# Altium project SQUIDCtr_Rev2.PrjPCB (part 2 of 2)

## Sheet Power.SchDoc: Power and Mechanical
size Letter; DrawnBy: J.-F. Cliche & Adam Gilbert; Engineer: J.-F. Cliche; DocumentNumber: 4; Revision: Rev2; SheetNumber: 4; SheetTotal: 5; ProjectTitle: DAN Squid Controller
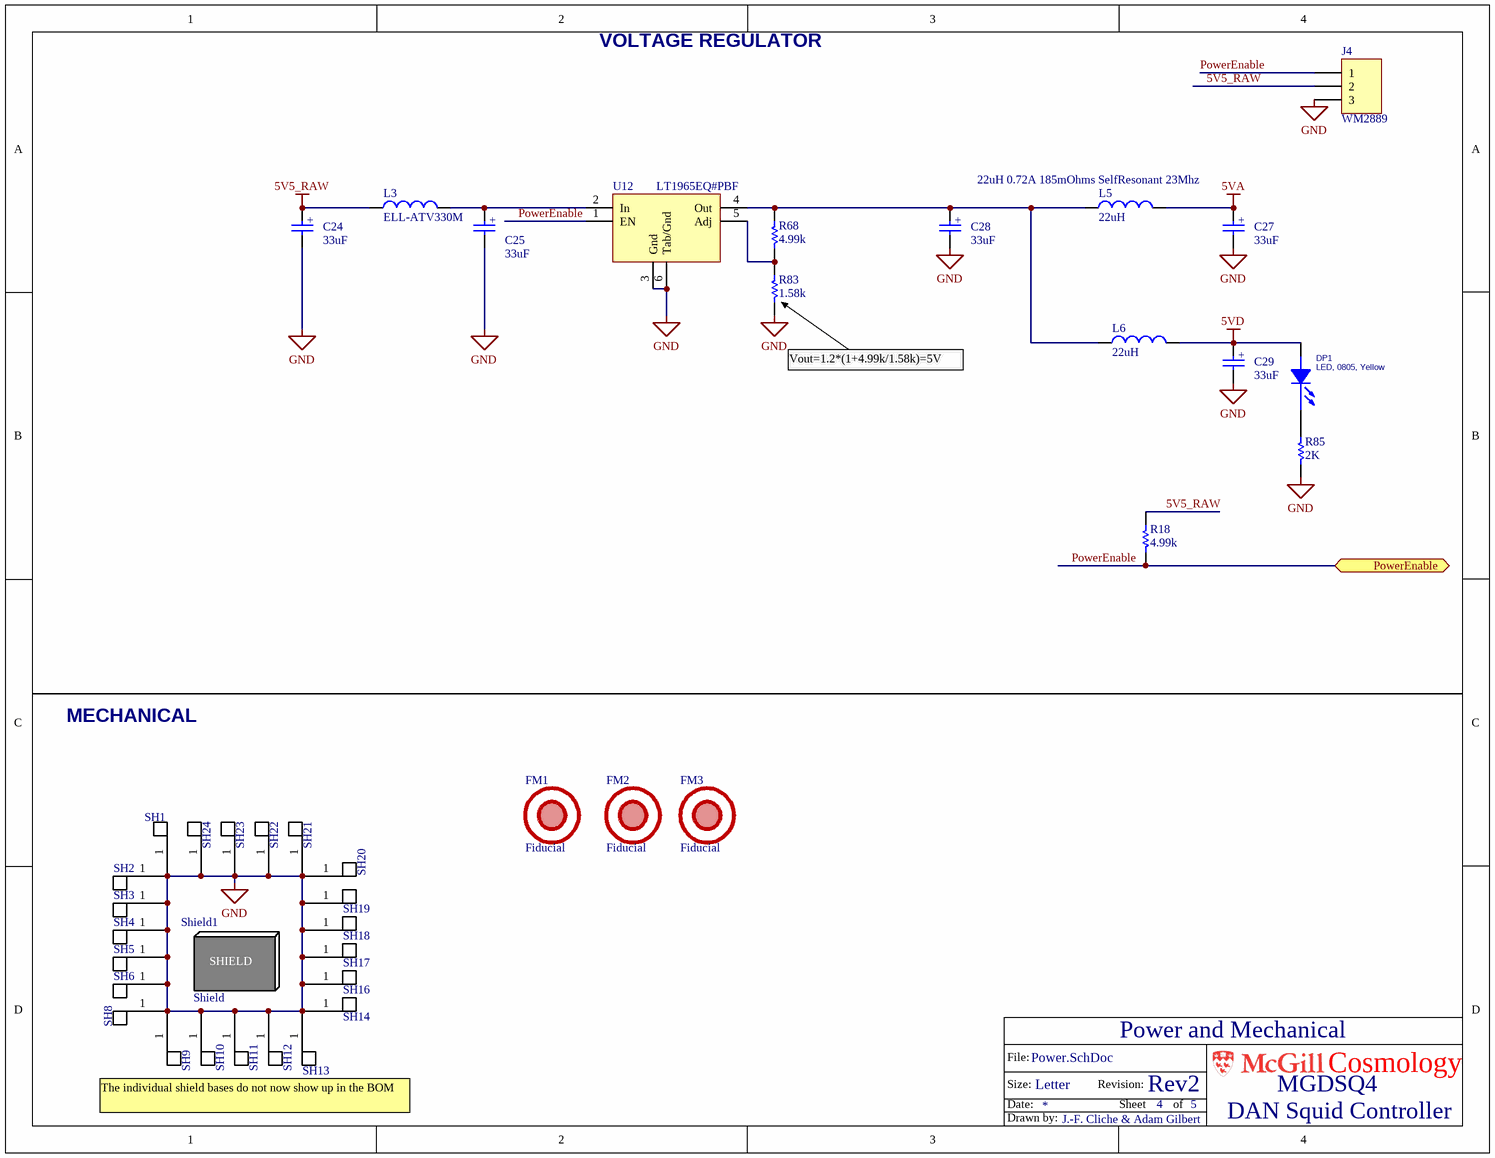
[diagram p3: Power.SchDoc]

### Parts
C24  33uF  [TCASE-D]
C25  33uF  [TCASE-D]
C27  33uF  [TCASE-D]
C28  33uF  [TCASE-D]
C29  33uF  [TCASE-D]
DP1  LED, 0805, Yellow  [0805L]
FM1  Fiducial  [Fiducial_mark]  (no BOM)
FM2  Fiducial  [Fiducial_mark]  (no BOM)
FM3  Fiducial  [Fiducial_mark]  (no BOM)
J4  WM2889  [HDR1X3_MolexVertical]
L3  ELL-ATV330M  [ELLATV]
L5  22uH  PartConstraints: 22uH 0.72A 185mOhms SelfResonant 23Mhz  [SRR4028]
L6  22uH  [SRR4028]
R18  4.99k  [0603]
R68  4.99k  [0603]
R83  1.58k  [0603]
R85  2k  [0603]
SH1  LeaderTech 20S-CBS-2x0.5x0.2 - DIVIDE QUANITY REQURIED BY 10!  [SHIELD BASE CORNER]  (value not drawn)  (no BOM)
SH2  LeaderTech 20S-CBS-2x0.5x0.2 - DIVIDE QUANITY REQURIED BY 10!  [SHIELD BASE]  (value not drawn)  (no BOM)
SH3  LeaderTech 20S-CBS-2x0.5x0.2 - DIVIDE QUANITY REQURIED BY 10!  [SHIELD BASE]  (value not drawn)  (no BOM)
SH4  LeaderTech 20S-CBS-2x0.5x0.2 - DIVIDE QUANITY REQURIED BY 10!  [SHIELD BASE]  (value not drawn)  (no BOM)
SH5  LeaderTech 20S-CBS-2x0.5x0.2 - DIVIDE QUANITY REQURIED BY 10!  [SHIELD BASE]  (value not drawn)  (no BOM)
SH6  LeaderTech 20S-CBS-2x0.5x0.2 - DIVIDE QUANITY REQURIED BY 10!  [SHIELD BASE]  (value not drawn)  (no BOM)
SH8  LeaderTech 20S-CBS-2x0.5x0.2 - DIVIDE QUANITY REQURIED BY 10!  [SHIELD BASE CORNER]  (value not drawn)  (no BOM)
SH9  LeaderTech 20S-CBS-2x0.5x0.2 - DIVIDE QUANITY REQURIED BY 10!  [SHIELD BASE]  (value not drawn)  (no BOM)
SH10  LeaderTech 20S-CBS-2x0.5x0.2 - DIVIDE QUANITY REQURIED BY 10!  [SHIELD BASE]  (value not drawn)  (no BOM)
SH11  LeaderTech 20S-CBS-2x0.5x0.2 - DIVIDE QUANITY REQURIED BY 10!  [SHIELD BASE]  (value not drawn)  (no BOM)
SH12  LeaderTech 20S-CBS-2x0.5x0.2 - DIVIDE QUANITY REQURIED BY 10!  [SHIELD BASE]  (value not drawn)  (no BOM)
SH13  LeaderTech 20S-CBS-2x0.5x0.2 - DIVIDE QUANITY REQURIED BY 10!  [SHIELD BASE CORNER]  (value not drawn)  (no BOM)
SH14  LeaderTech 20S-CBS-2x0.5x0.2 - DIVIDE QUANITY REQURIED BY 10!  [SHIELD BASE]  (value not drawn)  (no BOM)
SH16  LeaderTech 20S-CBS-2x0.5x0.2 - DIVIDE QUANITY REQURIED BY 10!  [SHIELD BASE]  (value not drawn)  (no BOM)
SH17  LeaderTech 20S-CBS-2x0.5x0.2 - DIVIDE QUANITY REQURIED BY 10!  [SHIELD BASE]  (value not drawn)  (no BOM)
SH18  LeaderTech 20S-CBS-2x0.5x0.2 - DIVIDE QUANITY REQURIED BY 10!  [SHIELD BASE]  (value not drawn)  (no BOM)
SH19  LeaderTech 20S-CBS-2x0.5x0.2 - DIVIDE QUANITY REQURIED BY 10!  [SHIELD BASE]  (value not drawn)  (no BOM)
SH20  LeaderTech 20S-CBS-2x0.5x0.2 - DIVIDE QUANITY REQURIED BY 10!  [SHIELD BASE CORNER]  (value not drawn)  (no BOM)
SH21  LeaderTech 20S-CBS-2x0.5x0.2 - DIVIDE QUANITY REQURIED BY 10!  [SHIELD BASE]  (value not drawn)  (no BOM)
SH22  LeaderTech 20S-CBS-2x0.5x0.2 - DIVIDE QUANITY REQURIED BY 10!  [SHIELD BASE]  (value not drawn)  (no BOM)
SH23  LeaderTech 20S-CBS-2x0.5x0.2 - DIVIDE QUANITY REQURIED BY 10!  [SHIELD BASE]  (value not drawn)  (no BOM)
SH24  LeaderTech 20S-CBS-2x0.5x0.2 - DIVIDE QUANITY REQURIED BY 10!  [SHIELD BASE]  (value not drawn)  (no BOM)
Shield1  Shield
U12  LT1965EQ#PBF  [D2-PAK-6_LT3080]

### Ports
PowerEnable

### Nets
5V5_RAW: C24.1 J4.2 L3.1 R18.2
5VA: C27.1 L5.2
5VD: C29.1 DP1.1(ANODE) L6.2
GND: C24.2 C25.2 C27.2 C28.2 C29.2 J4.3 R83.1 R85.2 SH1.1 SH2.1 SH3.1 SH4.1 SH5.1 SH6.1 SH8.1 SH9.1 SH10.1 SH11.1 SH12.1 SH13.1 SH14.1 SH16.1 SH17.1 SH18.1 SH19.1 SH20.1 SH21.1 SH22.1 SH23.1 SH24.1 U12.3(Gnd) U12.6(Tab/Gnd)
PowerEnable: J4.1 R18.1 U12.1(EN) ; port PowerEnable
NetC25_1: C25.1 L3.2 U12.2(In)
NetC28_1: C28.1 L5.1 L6.1 R68.2 U12.4(Out)
NetDP1_2: DP1.2(CATHODE) R85.1
NetR68_1: R68.1 R83.2 U12.5(Adj)

### Notes on the sheet
- VOLTAGE REGULATOR
- (near R83) Vout=1.2*(1+4.99k/1.58k)=5V
- MECHANICAL
- The individual shield bases do not now show up in the BOM
- File:
- Size:
- Date:
- Letter
- Revision:
- Sheet
- of
- Cosmology
- Drawn by:
- (in symbol SHIELD 20S-CBS-3x2.5x0.2) SHIELD
- (in symbol Tantalum) +

### Library data of the parts
C24 C25 C27-C29 = Tantalum: CAP TANT CASE-D; Manufacturer: Generic; Part Constraints: CAP TANT 33UF 16V 20% 2917; Voltage: 16V; ESR: 100mOhms; Footprint: D; Value: 33uF; Supplier 1: Digi-Key
  C24: Supplier Part Number 1: 399-4738-2-ND; Supplier 2: Digi-Key; Supplier Part Number 2: 399-4738-1-ND
  C25 C27-C29: Supplier Part Number 1: 399-4738-1-ND
DP1 = LED, yellow, 0805, 2mA: LED; Part Constraints: 511-1293-1-ND; Supplier 1: Digi-Key; Supplier Part Number 1: 511-1293-1-ND
J4 = Header 3: 3-Pin 0.1" header; Manufacturer: Digikey; Part Constraints: WM2889; Supplier 1: Molex; Supplier Part Number 1: WM2889-ND
L3 = ELL-ATV330M: 33uH 1.8A inductor 10mmx10mm; Manufacturer: Panasonic - ECG; Inductance: 33µH; Type: Ferrite Core; Tolerance: ±20%; Shielding: Shielded; DC Resistance (DCR): 62 mOhm; Frequency - Test: 100kHz; RoHS: RoHS Compliant; Category: Inductors, Coils, Chokes; Stock 1: 6281; Pricing 1: 1=2.28, 10=2.15, 50=2.0154, 100=1.8811 (CAD); Current: 1.8A; Current - Saturation: -; Current - Temperature Rise: -; Q @ Freq: -; Frequency - Self Resonant: -; Applications: General Purpose; Material - Core: -; Package / Case: 0.394" L x 0.394" W x 0.177" H (10.00mm x 10.00mm x 4.50mm); Mounting Type: Surface Mount; Packaging: Cut Tape (CT); Operating Temperature: -; ComponentLink1URL: http://industrial.panasonic.com/www-cgi/jvcr13pz.cgi?E+PZ+2+AGM0010+0+4+WW; ComponentLink1Description: http://industrial.panasonic.com/www-cgi/jvcr13pz.cgi?E+PZ+2+AGM0010+0+4+WW; Supplier 1: Digi-Key; Supplier Part Number 1: PCD1754CT-ND; Part Constraints: ELL-ATV330M
L5 = InductorSRR4028: =PartConstraints; Manufacturer: Bourns; Part Constraints: SRR4028-220YCT-ND; Resistance: 185mOhms; CurrentRating: 0.72A; SRF: SelfResonant 23Mhz; Inductance: 22uH; Supplier 1: Digi-Key; Supplier Part Number 1: SRR4028-220YCT-ND
L6 = InductorSRR4028: =PartConstraints; Manufacturer: Bourns; PartConstraints: 22uH 0.72A 185mOhms SelfResonant 23Mhz; Part Constraints: SRR4028-220YCT-ND; Resistance: 185mOhms; CurrentRating: 0.72A; SRF: SelfResonant 23Mhz; Inductance: 22uH; Supplier 1: Digi-Key; Supplier Part Number 1: SRR4028-220YCT-ND
R18 R68 = Res0603: RES 0603; Manufacturer: Generic; Part constraints: RES 4.99K OHM 1/10W 1% 0603 SMD; Manufacturer Part Number 1: e.g CRCW0603 series; Value: 4.99k; Supplier 1: Digi-Key; Supplier Part Number 1: 541-4.99KHCT-ND
R83 = Res0603: RES 0603; Manufacturer: Generic; Part constraints: RES 1.58K OHM 1/10W 1% 0603 SMD; Manufacturer Part Number 1: e.g CRCW0603 series; Value: 1.58k; Supplier 1: Digi-Key; Supplier Part Number 1: 541-1.58KHCT-ND
R85 = Res0603: RES 0603; Manufacturer: Generic; Part constraints: RES 2.00K OHM 1/10W 1% 0603 SMD; Manufacturer Part Number 1: e.g CRCW0603 series; Value: 2K; Supplier 1: Digi-Key; Supplier Part Number 1: 541-2.00KHCT-ND
SH1-SH6 SH8-SH14 SH16-SH24 = ShieldBase: Part Constraints: 20S-CBS-3x2.5x0.2  (divide quantity by 22); Manufacturer: LeaderTech; Supplier 1: LeaderTech; Supplier Part Number 1: 20S-CBS-3x2.5x0.2  (divide quantity by 22)
Shield1 = SHIELD 20S-CBS-3x2.5x0.2: 20S-CBSA-3x2.5x0.2 (assembled fence and cover); Manufacturer: Leadertech; Supplier 1: Leadertech; Supplier Part Number 1: 20S-CBSA-3x2.5x0.2 (assembled fence and cover); Part Constraints: 20S-CBSA-3x2.5x0.2 (assembled fence and cover)
U12 = LT1965EQ: Low dropout regulator, single resistor, 1.1A; Manufacturer 1: Linear Technology; Description 1: IC REG LDO ADJ 1.1A 5-DD; Category 1: Integrated Circuits (ICs); Regulator Topology: Positive Adjustable; Voltage - Output: 1.2 V ~ 19.5 V; Voltage - Input: 1.8 V ~ 20 V; Voltage - Dropout (Typical): 0.31V @ 1.1A; Number of Regulators: 1; Current - Limit (Min): 1.2A; Supplier 1: Digi-Key; Manufacturer Part Number 1: LT1965EQ#PBF; RoHS 1: RoHS Compliant; Stock 1: 1301; Pricing 1: 1=4.88, 25=3.486, 100=2.8753 (CAD); Current - Output: 1.1A; Operating Temperature: -40°C ~ 125°C; Mounting Type: Surface Mount; Package / Case: TO-263-6, D²Pak (5 Leads + Tab), TO-263BA; Supplier Device Package: D2PAK-5; Packaging: Tube; ComponentLink1URL: http://www.linear.com/docs/25320; ComponentLink1Description: http://www.linear.com/docs/25320; Supplier Part Number 1: LT1965EQ#PBF-ND

## Sheet Control.SchDoc: Control logic
size Letter; DrawnBy: J.-F. Cliche & Adam Gilbert; Engineer: J.-F. Cliche; DocumentNumber: 5; Revision: Rev2; SheetNumber: 5; SheetTotal: 5; ProjectTitle: DAN Squid Controller
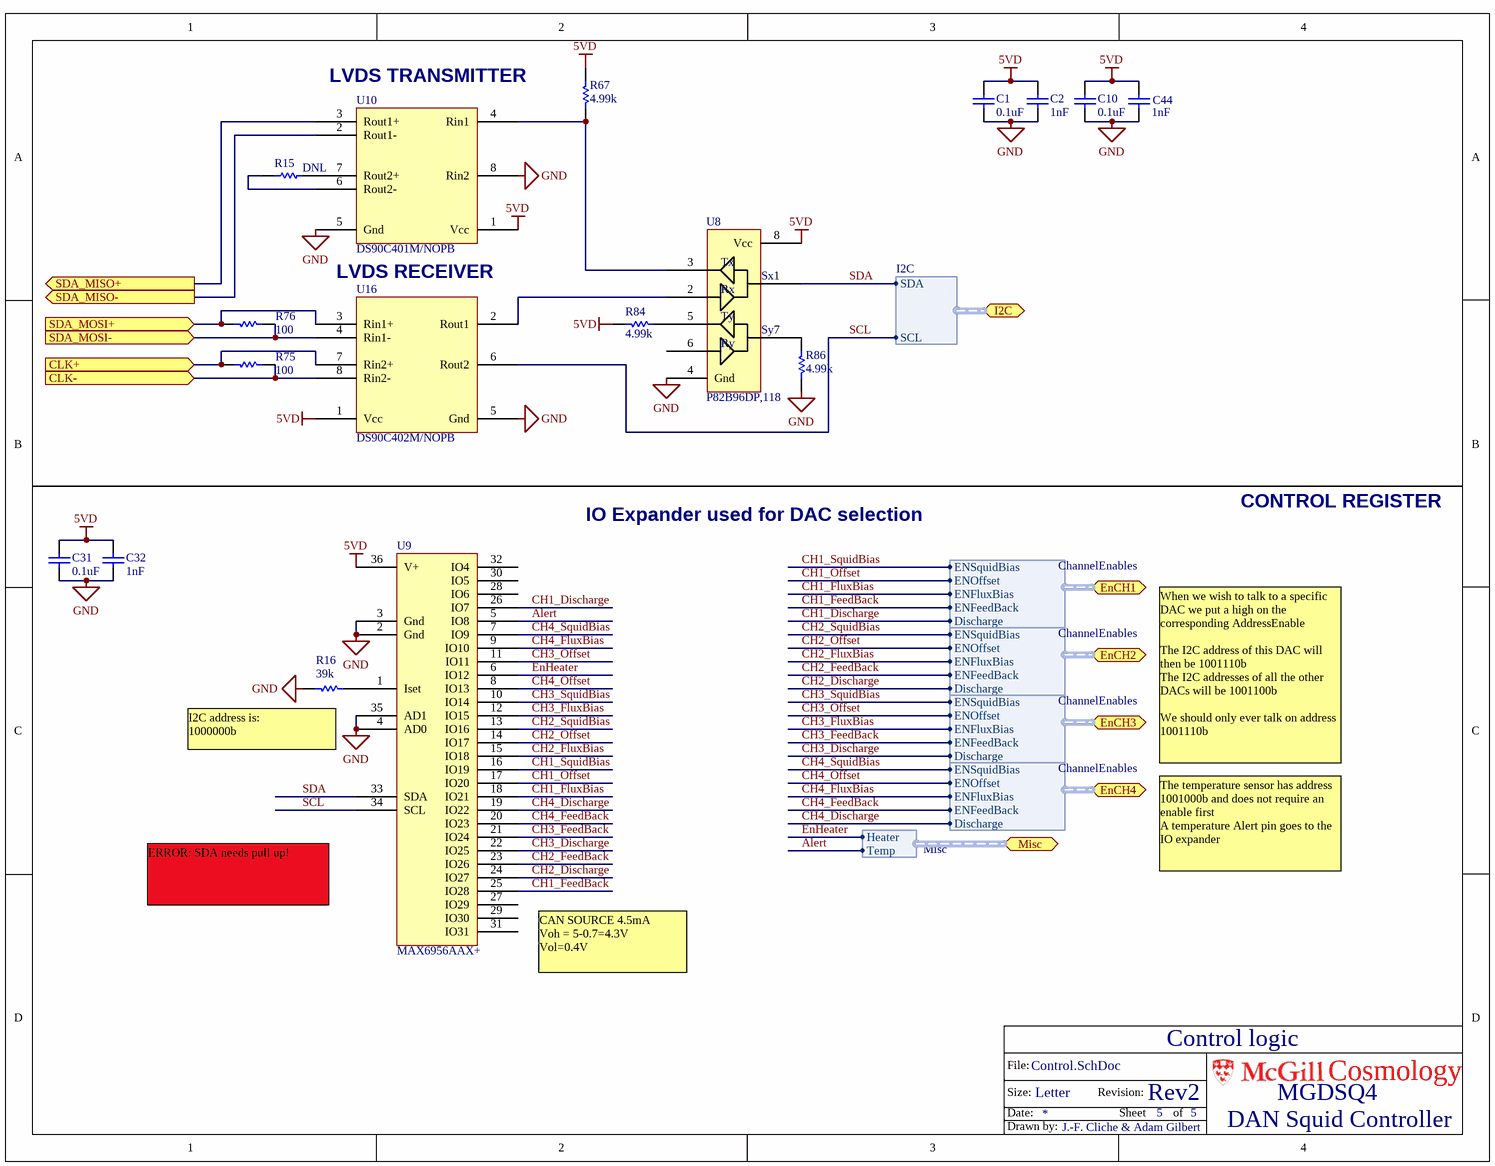
[diagram p4: Control.SchDoc]

### Parts
C1  0.1uF  [0603]
C2  1nF  [0603]
C10  0.1uF  [0603]
C31  0.1uF  [0603]
C32  1nF  [0603]
C44  1nF  [0603]
R15  DNL  [0603]
R16  39k
R67  4.99k  [0603]
R75  100  [0603]
R76  100  [0603]
R84  4.99k  [0603]
R86  4.99k  [0603]
U8  P82B96DP,118  [MSOP8-P82B96]
U9  MAX6956AAX+  [SOP36Body15.4mmx7.5mm]
U10  DS90C401M/NOPB  [SO8]
U16  DS90C402M/NOPB  [SO8]

### Ports
CLK+ (in), CLK- (in), EnCH1 (harness ChannelEnables), EnCH2 (harness ChannelEnables), EnCH3 (harness ChannelEnables), EnCH4 (harness ChannelEnables), I2C (harness I2C), Misc (harness Misc), SDA_MISO+ (out), SDA_MISO- (out), SDA_MOSI+ (in), SDA_MOSI- (in)

### Harnesses
I2C: SDA, SCL
ChannelEnables: ENSquidBias, ENOffset, ENFluxBias, ENFeedBack, Discharge
Misc: Heater, Temp

### Nets
5VD: C1.2 C2.2 C10.2 C31.2 C32.2 C44.2 R67.2 R84.2 U8.8(Vcc) U9.36(V+) U10.1(Vcc) U16.1(Vcc)
GND: C1.1 C2.1 C10.1 C31.1 C32.1 C44.1 R16.2 R86.1 U8.4(Gnd) U9.2(Gnd) U9.3(Gnd) U9.4(AD0) U9.35(AD1) U10.5(Gnd) U10.8(Rin2) U16.5(Gnd)
Alert: U9.5(IO8) ; port Misc.Temp
CH1_Discharge: U9.26(IO7) ; port EnCH1.Discharge  [project net EnCh1.Discharge]
CH1_FeedBack: U9.25(IO28) ; port EnCH1.ENFeedBack  [project net EnCh1.ENFeedBack]
CH1_FluxBias: U9.18(IO21) ; port EnCH1.ENFluxBias  [project net EnCh1.ENFluxBias]
CH1_Offset: U9.17(IO20) ; port EnCH1.ENOffset  [project net EnCh1.ENOffset]
CH1_SquidBias: U9.16(IO19) ; port EnCH1.ENSquidBias  [project net EnCh1.ENSquidBias]
CH2_Discharge: U9.24(IO27) ; port EnCH2.Discharge  [project net EnCh2.Discharge]
CH2_FeedBack: U9.23(IO26) ; port EnCH2.ENFeedBack  [project net EnCh2.ENFeedBack]
CH2_FluxBias: U9.15(IO18) ; port EnCH2.ENFluxBias  [project net EnCh2.ENFluxBias]
CH2_Offset: U9.14(IO17) ; port EnCH2.ENOffset  [project net EnCh2.ENOffset]
CH2_SquidBias: U9.13(IO16) ; port EnCH2.ENSquidBias  [project net EnCh2.ENSquidBias]
CH3_Discharge: U9.22(IO25) ; port EnCH3.Discharge  [project net EnCh3.Discharge]
CH3_FeedBack: U9.21(IO24) ; port EnCH3.ENFeedBack  [project net EnCh3.ENFeedBack]
CH3_FluxBias: U9.12(IO15) ; port EnCH3.ENFluxBias  [project net EnCh3.ENFluxBias]
CH3_Offset: U9.11(IO11) ; port EnCH3.ENOffset  [project net EnCh3.ENOffset]
CH3_SquidBias: U9.10(IO14) ; port EnCH3.ENSquidBias  [project net EnCh3.ENSquidBias]
CH4_Discharge: U9.19(IO22) ; port EnCH4.Discharge  [project net EnCh4.Discharge]
CH4_FeedBack: U9.20(IO23) ; port EnCH4.ENFeedBack  [project net EnCh4.ENFeedBack]
CH4_FluxBias: U9.9(IO10) ; port EnCH4.ENFluxBias  [project net EnCh4.ENFluxBias]
CH4_Offset: U9.8(IO13) ; port EnCH4.ENOffset  [project net EnCh4.ENOffset]
CH4_SquidBias: U9.7(IO9) ; port EnCH4.ENSquidBias  [project net EnCh4.ENSquidBias]
EnHeater: U9.6(IO12) ; port Misc.Heater
SCL: U9.34(SCL) U16.6(Rout2) ; port I2C.SCL  [project net I2C.SCL]
SCL_N: R75.1 U16.8(Rin2-) ; port CLK-
SCL_P: R75.2 U16.7(Rin2+) ; port CLK+
SDA: U8.1(Sx) U9.33(SDA) ; port I2C.SDA  [project net I2C.SDA]
SDA_MISO_N: U10.2(Rout1-) ; port SDA_MISO-
SDA_MISO_P: U10.3(Rout1+) ; port SDA_MISO+
SDA_MOSI_N: R76.1 U16.4(Rin1-) ; port SDA_MOSI-
SDA_MOSI_P: R76.2 U16.3(Rin1+) ; port SDA_MOSI+
NetR15_1: R15.1 U10.6(Rout2-)
NetR15_2: R15.2 U10.7(Rout2+)
NetR16_1: R16.1 U9.1(Iset)
NetR67_1: R67.1 U8.3(Tx) U10.4(Rin1)
NetR84_1: R84.1 U8.5(Ty)
NetR86_2: R86.2 U8.7(Sy)
NetU8_2: U8.2(Rx) U16.2(Rout1)

Not connected (* = marked no-connect by the designer): U8 6(Ry); U9 27(IO29) 28(IO6) 29(IO30) 30(IO5) 31(IO31) 32(IO4)

### Notes on the sheet
- (near U10) LVDS TRANSMITTER
- LVDS RECEIVER
- CONTROL REGISTER
- IO Expander used for DAC selection
- (near R16) I2C address is:
  1000000b
- When we wish to talk to a specific DAC we put a high on the corresponding AddressEnable
  The I2C address of this DAC will then be 1001110b
  The I2C addresses of all the other DACs will be 1001100b
  We should only ever talk on address 1001110b
- ERROR: SDA needs pull up!
- The temperature sensor has address 1001000b and does not require an enable first
  A temperature Alert pin goes to the IO expander
- CAN SOURCE 4.5mA
  Voh = 5-0.7=4.3V
  Vol=0.4V
- Labels drawn without touching a wire or pin: SCL
- File:
- Size:
- Date:
- Letter
- Revision:
- Sheet
- of
- Cosmology
- Drawn by:

### Library data of the parts
C1 C10 C31 = Cap0603: Capacitor, Ceramic, 0603; Part Constraints: 0.1uF 16V 10% X7R; Manufacturer: Generic; Supplier 1: Digi-Key; Supplier Part Number 1: 399-1096-1-ND; Value: 0.1uF
C2 C32 C44 = Cap0603: Capacitor, Ceramic, 0603; Part Constraints: 1nF 50V 10% X7R 0603; Manufacturer: Generic; Value: 1nF; Supplier 1: Digi-Key; Supplier Part Number 1: 399-1082-1-ND
R15 = Res0603: RES 0603; Manufacturer: Generic; Manufacturer Part Number 1: e.g CRCW0603 series; Value: DNL; Part constraints: DNL
R16 = RES 0603: Manufacturer: Generic; Manufacturer Part Number 1: CRCW060339K0FKEA; Part constraints: RES 100 OHM 1/10W 1% 0603 SMD; Manufacturer 1: Vishay Dale; Description 1: RES 39.0K OHM 1/10W 1% 0603 SMD; Category 1: Resistors; Power (Watts): 0.1W, 1/10W; Temperature Coefficient: ±100ppm/°C; Tolerance: ±1%; Footprint: 0603; Value: 39k; Supplier 1: Digi-Key; Supplier Part Number 1: 541-39.0KHCT-ND; RoHS 1: RoHS Compliant; Stock 1: 44932; Pricing 1: 10=0.096, 50=0.0516, 200=0.02965, 1000=0.02023 (CAD); Resistance (Ohms): 39k; Composition: Thick Film; Features: Automotive AEC-Q200 Qualified; Package / Case: 0603 (1608 Metric); Supplier Device Package: 0603 (1608 Metric); Size / Dimension: 0.061" L x 0.033" W (1.55mm x 0.85mm); Height: 0.020" (0.50mm); Number of Terminations: 2; Packaging: Cut Tape (CT); ComponentLink1URL: http://www.vishay.com/doc?20035; ComponentLink1Description: http://www.vishay.com/doc?20035
R67 R84 R86 = Res0603: as R18 on sheet Power; Value: 4.99k; Supplier 1: Digi-Key; Supplier Part Number 1: 541-4.99KHCT-ND
R75 R76 = RES 0603: Manufacturer: Generic; Manufacturer Part Number 1: e.g CRCW0603 series; Part constraints: RES 100 OHM 1/10W 1% 0603 SMD; Value: 100; Supplier 1: Digi-Key; Supplier Part Number 1: 541-100HCT-ND
U8 = P82B96: IC DUAL BI-DIR BUS BUFFER 8-TSSOP; Manufacturer 1: NXP Semiconductors; Description 1: IC DUAL BUS BUFF 8-TSSOP; Category 1: Integrated Circuits (ICs); Tx/Rx Type: I²C Logic; Delay Time: 5.0ns; Capacitance - Input: 7pF; Voltage - Supply: 2 V ~ 15 V; Current - Supply: 900µA; Supplier 1: Digi-Key; Manufacturer Part Number 1: P82B96DP,118; RoHS 1: RoHS Compliant; Stock 1: 6660; Pricing 1: 1=3.55, 10=3.18, 25=2.8588, 100=2.6001, 250=2.35368, 500=2.1072, 1000=1.77448 (CAD); Type: Buffer; Mounting Type: Surface Mount; Package / Case: 8-TSSOP, 8-MSOP (0.118", 3.00mm Width); Supplier Device Package: 8-TSSOP; Packaging: Cut Tape (CT); ComponentLink1URL: http://www.nxp.com/documents/data_sheet/P82B96.pdf; ComponentLink1Description: http://www.nxp.com/documents/data_sheet/P82B96.pdf; Supplier Part Number 1: 568-3197-1-ND
U9 = MAX6956AAX+: IO expander 28 IOs, I2C; Manufacturer 1: Maxim Integrated; Description 1: IC DRVR DSPL LED 36-SSOP; Category 1: Integrated Circuits (ICs); Display Type: LED; Interface: I²C; Current - Supply: 180µA; Voltage - Supply: 2.5 V ~ 5.5 V; Supplier 1: Digi-Key; Manufacturer Part Number 1: MAX6956AAX+; RoHS 1: RoHS Compliant; Stock 1: 19255; Pricing 1: 1=10.64, 25=7.4604, 100=5.4065, 500=4.75594 (CAD); Configuration: -; Digits or Characters: -; Operating Temperature: -40°C ~ 125°C; Mounting Type: Surface Mount; Package / Case: 36-BSOP (0.295", 7.50mm Width); Supplier Device Package: 36-SSOP; Packaging: Tube; ComponentLink1URL: http://datasheets.maximintegrated.com/en/ds/MAX6956.pdf; ComponentLink1Description: http://datasheets.maximintegrated.com/en/ds/MAX6956.pdf; Supplier Part Number 1: MAX6956AAX+-ND
U10 = DS90C401M/NOPB: IC DRV LVDS DUAL DIFF SGNL 8SOIC; Manufacturer 1: Texas Instruments; Manufacturer Part Number 1: DS90C401MX/NOPB; Description 1: IC DVR SIGNALING DUAL DIFF 8SOIC; Category 1: Integrated Circuits (ICs); Number of Drivers/Receivers: 2/0; Voltage - Supply: 4.5 V ~ 5.5 V; Supplier 1: Digi-Key; RoHS 1: RoHS Compliant; Stock 1: 2289; Pricing 1: 1=3.37, 10=3.044, 25=2.7264, 100=2.4519, 250=2.17716, 500=1.90238, 1000=1.57474 (CAD); Type: Driver; Protocol: LVDS; Mounting Type: Surface Mount; Package / Case: 8-SOIC (0.154", 3.90mm Width); Supplier Device Package: *; Packaging: Cut Tape (CT); ComponentLink1URL: http://www.ti.com/lit/ds/symlink/ds90c401.pdf; ComponentLink1Description: http://www.ti.com/lit/ds/symlink/ds90c401.pdf; Supplier Part Number 1: 296-35380-1-ND
U16 = DS90C402M/NOPB: IC REC LVDS DUAL DIFF SGNL 8SOIC; Manufacturer 1: Texas Instruments; Manufacturer Part Number 1: DS90C402MX/NOPB; Description 1: IC RVR SIGNALING DUAL DIFF 8SOIC; Category 1: Integrated Circuits (ICs); Number of Drivers/Receivers: 0/2; Voltage - Supply: 4.5 V ~ 5.5 V; Supplier 1: Digi-Key; RoHS 1: RoHS Compliant; Stock 1: 2460; Pricing 1: 1=3.3, 10=2.95, 25=2.6528, 100=2.4127, 250=2.18404, 500=1.95532, 1000=1.64659 (CAD); Type: Receiver; Protocol: LVDS; Mounting Type: Surface Mount; Package / Case: 8-SOIC (0.154", 3.90mm Width); Supplier Device Package: *; Packaging: Cut Tape (CT); ComponentLink1URL: http://www.ti.com/lit/ds/symlink/ds90c402.pdf; ComponentLink1Description: http://www.ti.com/lit/ds/symlink/ds90c402.pdf; Supplier Part Number 1: 296-35381-1-ND

## Nets that join several sheets
5V5_RAW: SQUIDCtrl_Rev2 (J2.2), Power (C24.1 J4.2 L3.1 R18.2)
5VA: CH1 (11 pins), CH1/REFS (9 pins), Power (C27.1 L5.2), CH2 (11 pins), CH2/REFS (9 pins), CH3 (11 pins), CH3/REFS (9 pins), CH4 (11 pins), CH4/REFS (9 pins)
5VD: SQUIDCtrl_Rev2 (5 pins), Power (C29.1 DP1.1 L6.2), Control (12 pins)
GND: SQUIDCtrl_Rev2 (15 pins), CH1 (23 pins), CH1/REFS (41 pins), Power (32 pins), Control (16 pins), CH2 (23 pins), CH2/REFS (41 pins), CH3 (23 pins), CH3/REFS (41 pins), CH4 (23 pins), CH4/REFS (41 pins)
Alert: SQUIDCtrl_Rev2 (U14.5), Control (U9.5)
CH1_CRYO.BOLO_N: SQUIDCtrl_Rev2 (J1.36), CH1 (R5_1.1)
CH1_CRYO.BOLO_P: SQUIDCtrl_Rev2 (J1.18), CH1 (R1_1.1)
CH1_CRYO.Heater_P: SQUIDCtrl_Rev2 (J1.15), CH1 (R7_1.1)
CH1_CRYO.SQUID_Bias_N: SQUIDCtrl_Rev2 (J1.34), CH1 (R82_1.1)
CH1_CRYO.SQUID_Bias_P: SQUIDCtrl_Rev2 (J1.16), CH1 (R81_1.2)
CH1_CRYO.SQUID_COIL_N: SQUIDCtrl_Rev2 (J1.37), CH1 (R36_1.2 R48_1.1)
CH1_CRYO.SQUID_COIL_P: SQUIDCtrl_Rev2 (J1.19), CH1 (R19_1.2 R28_1.1 R38_1.2)
CH1_CRYO.SQUID_Sense_N: SQUIDCtrl_Rev2 (J1.17), CH1 (7 pins), CH1/REFS (C45_1.2 C60_1.2 L9_1.1)
CH1_CRYO.SQUID_Sense_P: SQUIDCtrl_Rev2 (J1.35), CH1 (R51_1.2 R72_1.2 U2_1.3)
CH1_MEZZ.Bias_N: SQUIDCtrl_Rev2 (J2.18), CH1 (L2_1.4 R4_1.2)
CH1_MEZZ.Bias_P: SQUIDCtrl_Rev2 (J2.37), CH1 (L2_1.6 R4_1.1)
CH1_MEZZ.Nuller_N: SQUIDCtrl_Rev2 (J2.17), CH1 (L11_1.4 R35_1.2 R39_1.2)
CH1_MEZZ.Nuller_P: SQUIDCtrl_Rev2 (J2.36), CH1 (L11_1.6 R11_1.2 R35_1.1)
CH1_MEZZ.SQUID_Out_N: SQUIDCtrl_Rev2 (J2.16), CH1 (R55_1.2)
CH1_MEZZ.SQUID_Out_P: SQUIDCtrl_Rev2 (J2.35), CH1 (R57_1.2)
CH2_CRYO.BOLO_N: SQUIDCtrl_Rev2 (J1.31), CH2 (R5_2.1)
CH2_CRYO.BOLO_P: SQUIDCtrl_Rev2 (J1.13), CH2 (R1_2.1)
CH2_CRYO.Heater_P: SQUIDCtrl_Rev2 (J1.33), CH2 (R7_2.1)
CH2_CRYO.SQUID_Bias_N: SQUIDCtrl_Rev2 (J1.29), CH2 (R82_2.1)
CH2_CRYO.SQUID_Bias_P: SQUIDCtrl_Rev2 (J1.11), CH2 (R81_2.2)
CH2_CRYO.SQUID_COIL_N: SQUIDCtrl_Rev2 (J1.32), CH2 (R36_2.2 R48_2.1)
CH2_CRYO.SQUID_COIL_P: SQUIDCtrl_Rev2 (J1.14), CH2 (R19_2.2 R28_2.1 R38_2.2)
CH2_CRYO.SQUID_Sense_N: SQUIDCtrl_Rev2 (J1.12), CH2 (7 pins), CH2/REFS (C45_2.2 C60_2.2 L9_2.1)
CH2_CRYO.SQUID_Sense_P: SQUIDCtrl_Rev2 (J1.30), CH2 (R51_2.2 R72_2.2 U2_2.3)
CH2_MEZZ.Bias_N: SQUIDCtrl_Rev2 (J2.15), CH2 (L2_2.4 R4_2.2)
CH2_MEZZ.Bias_P: SQUIDCtrl_Rev2 (J2.34), CH2 (L2_2.6 R4_2.1)
CH2_MEZZ.Nuller_N: SQUIDCtrl_Rev2 (J2.14), CH2 (L11_2.4 R35_2.2 R39_2.2)
CH2_MEZZ.Nuller_P: SQUIDCtrl_Rev2 (J2.33), CH2 (L11_2.6 R11_2.2 R35_2.1)
CH2_MEZZ.SQUID_Out_N: SQUIDCtrl_Rev2 (J2.13), CH2 (R55_2.2)
CH2_MEZZ.SQUID_Out_P: SQUIDCtrl_Rev2 (J2.32), CH2 (R57_2.2)
CH3_CRYO.BOLO_N: SQUIDCtrl_Rev2 (J1.27), CH3 (R5_3.1)
CH3_CRYO.BOLO_P: SQUIDCtrl_Rev2 (J1.9), CH3 (R1_3.1)
CH3_CRYO.Heater_P: SQUIDCtrl_Rev2 (J1.6), CH3 (R7_3.1)
CH3_CRYO.SQUID_Bias_N: SQUIDCtrl_Rev2 (J1.25), CH3 (R82_3.1)
CH3_CRYO.SQUID_Bias_P: SQUIDCtrl_Rev2 (J1.7), CH3 (R81_3.2)
CH3_CRYO.SQUID_COIL_N: SQUIDCtrl_Rev2 (J1.28), CH3 (R36_3.2 R48_3.1)
CH3_CRYO.SQUID_COIL_P: SQUIDCtrl_Rev2 (J1.10), CH3 (R19_3.2 R28_3.1 R38_3.2)
CH3_CRYO.SQUID_Sense_N: SQUIDCtrl_Rev2 (J1.8), CH3 (7 pins), CH3/REFS (C45_3.2 C60_3.2 L9_3.1)
CH3_CRYO.SQUID_Sense_P: SQUIDCtrl_Rev2 (J1.26), CH3 (R51_3.2 R72_3.2 U2_3.3)
CH3_MEZZ.Bias_N: SQUIDCtrl_Rev2 (J2.11), CH3 (L2_3.4 R4_3.2)
CH3_MEZZ.Bias_P: SQUIDCtrl_Rev2 (J2.30), CH3 (L2_3.6 R4_3.1)
CH3_MEZZ.Nuller_N: SQUIDCtrl_Rev2 (J2.10), CH3 (L11_3.4 R35_3.2 R39_3.2)
CH3_MEZZ.Nuller_P: SQUIDCtrl_Rev2 (J2.29), CH3 (L11_3.6 R11_3.2 R35_3.1)
CH3_MEZZ.SQUID_Out_N: SQUIDCtrl_Rev2 (J2.9), CH3 (R55_3.2)
CH3_MEZZ.SQUID_Out_P: SQUIDCtrl_Rev2 (J2.28), CH3 (R57_3.2)
CH4_CRYO.BOLO_N: SQUIDCtrl_Rev2 (J1.22), CH4 (R5_4.1)
CH4_CRYO.BOLO_P: SQUIDCtrl_Rev2 (J1.4), CH4 (R1_4.1)
CH4_CRYO.Heater_P: SQUIDCtrl_Rev2 (J1.24), CH4 (R7_4.1)
CH4_CRYO.SQUID_Bias_N: SQUIDCtrl_Rev2 (J1.20), CH4 (R82_4.1)
CH4_CRYO.SQUID_Bias_P: SQUIDCtrl_Rev2 (J1.2), CH4 (R81_4.2)
CH4_CRYO.SQUID_COIL_N: SQUIDCtrl_Rev2 (J1.23), CH4 (R36_4.2 R48_4.1)
CH4_CRYO.SQUID_COIL_P: SQUIDCtrl_Rev2 (J1.5), CH4 (R19_4.2 R28_4.1 R38_4.2)
CH4_CRYO.SQUID_Sense_N: SQUIDCtrl_Rev2 (J1.3), CH4 (7 pins), CH4/REFS (C45_4.2 C60_4.2 L9_4.1)
CH4_CRYO.SQUID_Sense_P: SQUIDCtrl_Rev2 (J1.21), CH4 (R51_4.2 R72_4.2 U2_4.3)
CH4_MEZZ.Bias_N: SQUIDCtrl_Rev2 (J2.8), CH4 (L2_4.4 R4_4.2)
CH4_MEZZ.Bias_P: SQUIDCtrl_Rev2 (J2.27), CH4 (L2_4.6 R4_4.1)
CH4_MEZZ.Nuller_N: SQUIDCtrl_Rev2 (J2.7), CH4 (L11_4.4 R35_4.2 R39_4.2)
CH4_MEZZ.Nuller_P: SQUIDCtrl_Rev2 (J2.26), CH4 (L11_4.6 R11_4.2 R35_4.1)
CH4_MEZZ.SQUID_Out_N: SQUIDCtrl_Rev2 (J2.6), CH4 (R55_4.2)
CH4_MEZZ.SQUID_Out_P: SQUIDCtrl_Rev2 (J2.25), CH4 (R57_4.2)
EnCh1.Discharge: CH1 (R34_1.1), Control (U9.26)
EnCh1.ENFeedBack: CH1 (R33_1.2 R74_1.1), Control (U9.25)
EnCh1.ENFluxBias: CH1/REFS (U4_1.5), Control (U9.18)
EnCh1.ENOffset: CH1/REFS (U6_1.5), Control (U9.17)
EnCh1.ENSquidBias: CH1/REFS (U3_1.5), Control (U9.16)
EnCh2.Discharge: Control (U9.24), CH2 (R34_2.1)
EnCh2.ENFeedBack: Control (U9.23), CH2 (R33_2.2 R74_2.1)
EnCh2.ENFluxBias: Control (U9.15), CH2/REFS (U4_2.5)
EnCh2.ENOffset: Control (U9.14), CH2/REFS (U6_2.5)
EnCh2.ENSquidBias: Control (U9.13), CH2/REFS (U3_2.5)
EnCh3.Discharge: Control (U9.22), CH3 (R34_3.1)
EnCh3.ENFeedBack: Control (U9.21), CH3 (R33_3.2 R74_3.1)
EnCh3.ENFluxBias: Control (U9.12), CH3/REFS (U4_3.5)
EnCh3.ENOffset: Control (U9.11), CH3/REFS (U6_3.5)
EnCh3.ENSquidBias: Control (U9.10), CH3/REFS (U3_3.5)
EnCh4.Discharge: Control (U9.19), CH4 (R34_4.1)
EnCh4.ENFeedBack: Control (U9.20), CH4 (R33_4.2 R74_4.1)
EnCh4.ENFluxBias: Control (U9.9), CH4/REFS (U4_4.5)
EnCh4.ENOffset: Control (U9.8), CH4/REFS (U6_4.5)
EnCh4.ENSquidBias: Control (U9.7), CH4/REFS (U3_4.5)
EnHeater: SQUIDCtrl_Rev2 (U13.5), Control (U9.6)
FLUX_BIAS_Filtered_CH1: CH1 (R38_1.1), CH1/REFS (C26_1.1 C46_1.1 R23_1.2)
FLUX_BIAS_Filtered_CH2: CH2 (R38_2.1), CH2/REFS (C26_2.1 C46_2.1 R23_2.2)
FLUX_BIAS_Filtered_CH3: CH3 (R38_3.1), CH3/REFS (C26_3.1 C46_3.1 R23_3.2)
FLUX_BIAS_Filtered_CH4: CH4 (R38_4.1), CH4/REFS (C26_4.1 C46_4.1 R23_4.2)
HeaterDACVoltage: SQUIDCtrl_Rev2 (U13.3 U13.4), CH1 (R6_1.2), CH2 (R6_2.2), CH3 (R6_3.2), CH4 (R6_4.2)
I2C.SCL: SQUIDCtrl_Rev2 (U13.6 U14.4), CH1/REFS (U3_1.6 U4_1.6 U6_1.6), Control (U9.34 U16.6), CH2/REFS (U3_2.6 U4_2.6 U6_2.6), CH3/REFS (U3_3.6 U4_3.6 U6_3.6), CH4/REFS (U3_4.6 U4_4.6 U6_4.6)
I2C.SDA: SQUIDCtrl_Rev2 (U13.7 U14.6), CH1/REFS (U3_1.7 U4_1.7 U6_1.7), Control (U8.1 U9.33), CH2/REFS (U3_2.7 U4_2.7 U6_2.7), CH3/REFS (U3_3.7 U4_3.7 U6_3.7), CH4/REFS (U3_4.7 U4_4.7 U6_4.7)
OFFSET_Filtered_CH1: CH1 (R59_1.1), CH1/REFS (C51_1.1 C62_1.1 R27_1.2)
OFFSET_Filtered_CH2: CH2 (R59_2.1), CH2/REFS (C51_2.1 C62_2.1 R27_2.2)
OFFSET_Filtered_CH3: CH3 (R59_3.1), CH3/REFS (C51_3.1 C62_3.1 R27_3.2)
OFFSET_Filtered_CH4: CH4 (R59_4.1), CH4/REFS (C51_4.1 C62_4.1 R27_4.2)
PowerEnable: SQUIDCtrl_Rev2 (R87.1), Power (J4.1 R18.1 U12.1)
SCL_N: SQUIDCtrl_Rev2 (J2.3), Control (R75.1 U16.8)
SCL_P: SQUIDCtrl_Rev2 (J2.22), Control (R75.2 U16.7)
SDA_MISO_N: SQUIDCtrl_Rev2 (J2.5), Control (U10.2)
SDA_MISO_P: SQUIDCtrl_Rev2 (J2.24), Control (U10.3)
SDA_MOSI_N: SQUIDCtrl_Rev2 (J2.4), Control (R76.1 U16.4)
SDA_MOSI_P: SQUIDCtrl_Rev2 (J2.23), Control (R76.2 U16.3)
SQUID_BIAS_Filtered_CH1: CH1 (R51_1.1 R81_1.1), CH1/REFS (C13_1.1 C61_1.1 R41_1.2)
SQUID_BIAS_Filtered_CH2: CH2 (R51_2.1 R81_2.1), CH2/REFS (C13_2.1 C61_2.1 R41_2.2)
SQUID_BIAS_Filtered_CH3: CH3 (R51_3.1 R81_3.1), CH3/REFS (C13_3.1 C61_3.1 R41_3.2)
SQUID_BIAS_Filtered_CH4: CH4 (R51_4.1 R81_4.1), CH4/REFS (C13_4.1 C61_4.1 R41_4.2)